# EAGLE design ColorsoundPowerBooster (EAGLE 9.2.0)
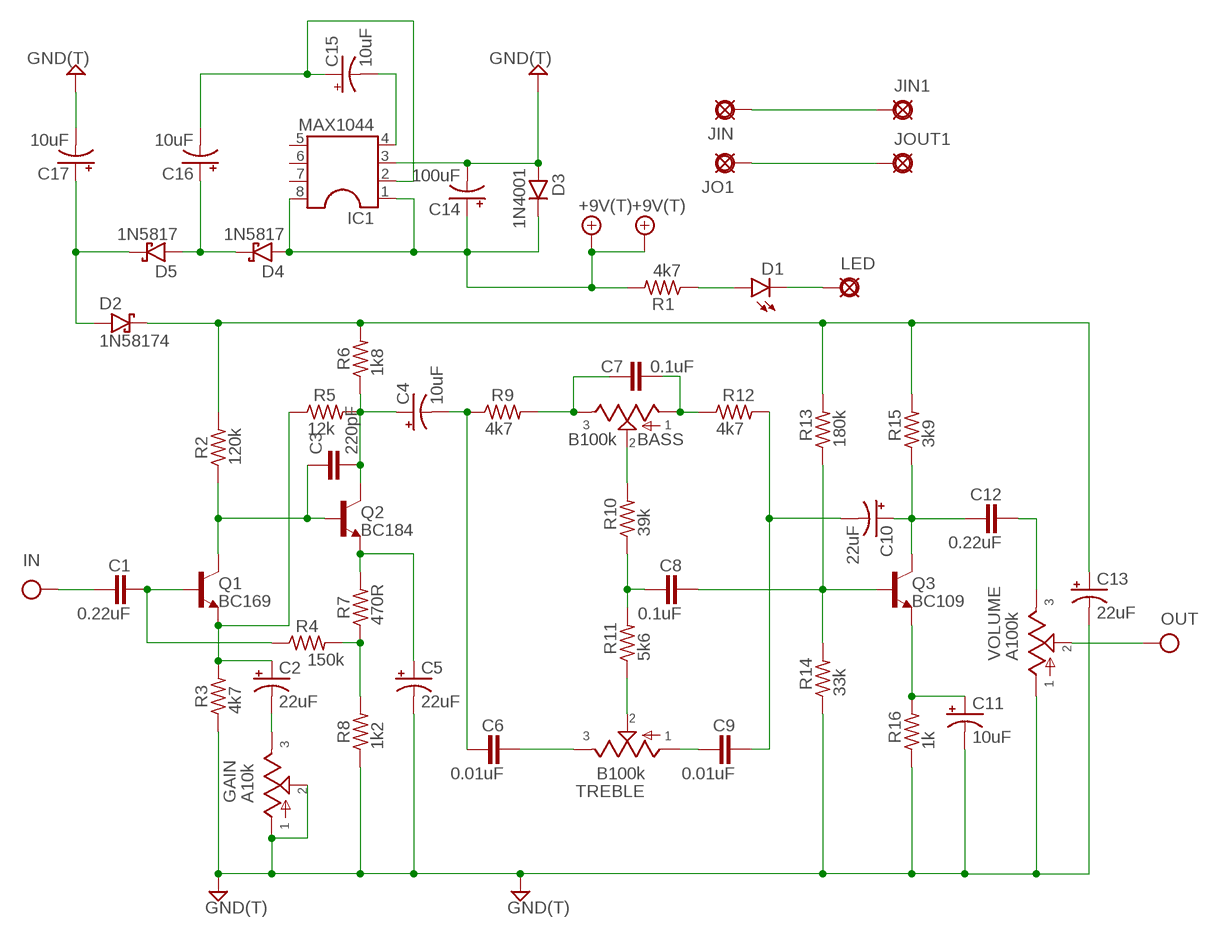
[diagram p0: schematic, sheet 1]

## Parts
+9V  +9V(T)  [SQUARE]
+9V1  +9V(T)  [SQUARE]
BASS  B100k  POT16MM  [16MM]
C1  0.22uF  072X0252  [072X025]
C2  22uF  0501  [050_020_1]
C3  220pF  050X030_0251  [050X030_025]
C4  10uF  0501  [050_020_1]
C5  22uF  0501  [050_020_1]
C6  0.01uF  072X0252  [072X025]
C7  0.1uF  072X0252  [072X025]
C8  0.1uF  072X0252  [072X025]
C9  0.01uF  072X0252  [072X025]
C10  22uF  0501  [050_020_1]
C11  10uF  0501  [050_020_1]
C12  0.22uF  072X0252  [072X025]
C13  22uF  0501  [050_020_1]
C14  100uF  0801  [080_035_1]
C15  10uF  0501  [050_020_1]
C16  10uF  0501  [050_020_1]
C17  10uF  0501  [050_020_1]
D1  LED  LED3MM  [LED3MM]
D2  1N58174  [DO41-4]
D3  1N4001  1N400X.3  [DO41-3]
D4  1N5817  [DO41-3]
D5  1N5817  [DO41-3]
G  GND(T)  [SQUARE]
G6  GND(T)  [SQUARE]
GAIN  A10k  POT16MM  [16MM]
IC1  MAX1044  [DIL08]
IN  IN(T)  [SQUARE]
JIG  GND(T)  [SQUARE]
JIN  PAD  [SQUARE]
JIN1  PAD  [SQUARE]
JO1  PAD  [SQUARE]
JOG  GND(T)  [SQUARE]
JOUT1  PAD  [SQUARE]
LED  PAD  [SQUARE]
OUT  OUT(T)  [SQUARE]
Q1  BC169  BC109  [TO92-]
Q2  BC184  BC109  [TO92-]
Q3  BC109  [TO92-]
R1  4k7  6MM.3  [R0207/3]
R2  120k  6MM.3  [R0207/3]
R3  4k7  6MM.3  [R0207/3]
R4  150k  6MM.3  [R0207/3]
R5  12k  6MM.3  [R0207/3]
R6  1k8  6MM.3  [R0207/3]
R7  470R  6MM.3  [R0207/3]
R8  1k2  6MM.3  [R0207/3]
R9  4k7  6MM.3  [R0207/3]
R10  39k  6MM.3  [R0207/3]
R11  5k6  6MM.3  [R0207/3]
R12  4k7  6MM.3  [R0207/3]
R13  180k  6MM.3  [R0207/3]
R14  33k  6MM.3  [R0207/3]
R15  3k9  6MM.3  [R0207/3]
R16  1k  6MM.3  [R0207/3]
TREBLE  B100k  POT16MM  [16MM]
VOLUME  A100k  POT16MM  [16MM]

## Nets
+9V: +9V1.1(+9V) +9V.1(+9V) C14.+ D3.C D4.A IC1.1 IC1.8 R1.2
GND: C5.- C11.- C13.- C14.- C17.- D3.A G6.1(GND) G.1(GND) GAIN.1 GAIN.2 IC1.3 JIG.1(GND) JOG.1(GND) R3.1 R8.1 R14.1 R16.1 VOLUME.1
IN: C1.1 IN.1(IN)
N$1: C4.- C6.1 R9.1
N$2: C6.2 TREBLE.3
N$3: C1.2 Q1.2(B) R4.1
N$4: C2.+ Q1.1(E) R3.2 R5.1
N$5: C2.- GAIN.3
N$6: C3.1 Q1.3(C) Q2.2(B) R2.1
N$7: C3.2 C4.+ Q2.3(C) R5.2 R6.1
N$8: C5.+ Q2.1(E) R7.2
N$9: R4.2 R7.1 R8.2
N$10: C13.+ D2.C R2.2 R6.2 R13.2 R15.2
N$11: R11.1 TREBLE.2
N$12: C8.1 R10.1 R11.2
N$13: BASS.2 R10.2
N$16: C9.2 C10.- R12.2
N$17: C8.2 Q3.2(B) R13.1 R14.2
N$18: C9.1 TREBLE.1
N$19: C10.+ C12.1 Q3.3(C) R15.1
N$20: C11.+ Q3.1(E) R16.2
N$21: D1.A R1.1
N$22: D1.K(C) LED.1(PAD)
N$23: C12.2 VOLUME.3
N$24: JIN1.1(PAD) JIN.1(PAD)
N$25: C15.- IC1.4
N$26: C15.+ C16.- IC1.2
N$27: C16.+ D4.C D5.A
N$28: C17.+ D2.A D5.C
N$29: JO1.1(PAD) JOUT1.1(PAD)
N$30: BASS.3 C7.1 R9.2
N$31: BASS.1 C7.2 R12.1
OUT: OUT.1(OUT) VOLUME.2
Unconnected: IC1.5 IC1.6 IC1.7

## Library data of the parts
+9V +9V1 = mb_supply:+9V(T): +9V Voltage Supply use this to hook up +9v throughout a schematic instead of running wire automatically labels the net "+9v" adds a hookup pad to the circuit board
BASS GAIN TREBLE VOLUME = mb_pots:POT: Potentiometers the arrow indicates the clockwise motion of th wiper (lug 2) fully counter clockwise there is no resistance between lugs 1 and 2 fully clockwise the resistance between lugs 1 and 2 is the value of the pot
C1 C6-C9 C12 = mb_caps-box:072X025: 1000pF - 0.47uF WIMA MKP2 63, 100V: 1000pF - 0.015uF; MKS2 50V: 0.33 - 0.47uF; 63V: 1000pF - 0.22uF;
C2 C4 C5 C10 C11 C13 C15-C17 = mb_caps-electro:050: 0.22 - 100uF Xicon values at Mouser.com: 10V: 10 - 100uF; 16V: 2.2 - 47uF; 25V: 0.47 - 47uF; 50V: 0.22 - 22uF
C3 = mb_caps-ceramic:050X030_025: 47 - 120pF Xicon Ceramic Disc 2.5mm lead spacing
C14 = mb_caps-electro:080: 47 - 470uF Xicon values at Mouser.com 10V: 330, 470uF; 16V: 220, 330uF; 25V: 220uF; 50V: 47, 100uF
D1 = mb_diodes:LED
D2 D4 D5 = mb_diodes:1N5817
D3 = mb_diodes:1N400X: Rectifier Diodes often used in power supply to prevent damage from reverse polarization
G G6 JIG JOG = mb_supply:GND(T): Ground use this to hook up ground (GND) throughout a schematic instead of running wire automatically labels the net "GND" adds a hookup pad to the circuit board (you can use several)
IC1 = mb_ics:MAX1044
IN = mb_supply:IN(T): Input obsolete: use Pad instead and label net shematic input label with circuit board terminal/pad generally used only once on a schematic (because this device labels the net "IN" in the same way as a voltage supply or ground net)
JIN JIN1 JO1 JOUT1 LED = mb_supply:PAD: PAD use this package for pads with any purpose, including input, output, send or return various pad shapes: round, square, octogonal, long, and long offset
OUT = mb_supply:OUT(T): Output obsolete: use Pad instead and label net output label with circuit board terminal/pad usually appears only once on a schematic
Q1-Q3 = mb_trans:BC109
R1-R16 = mb_resistors:6MM: 6mm Resistors Leads spaced 1-6 holes apart for 0.1" perfboard. Suitable for 1/4 watt resistors.

## Board
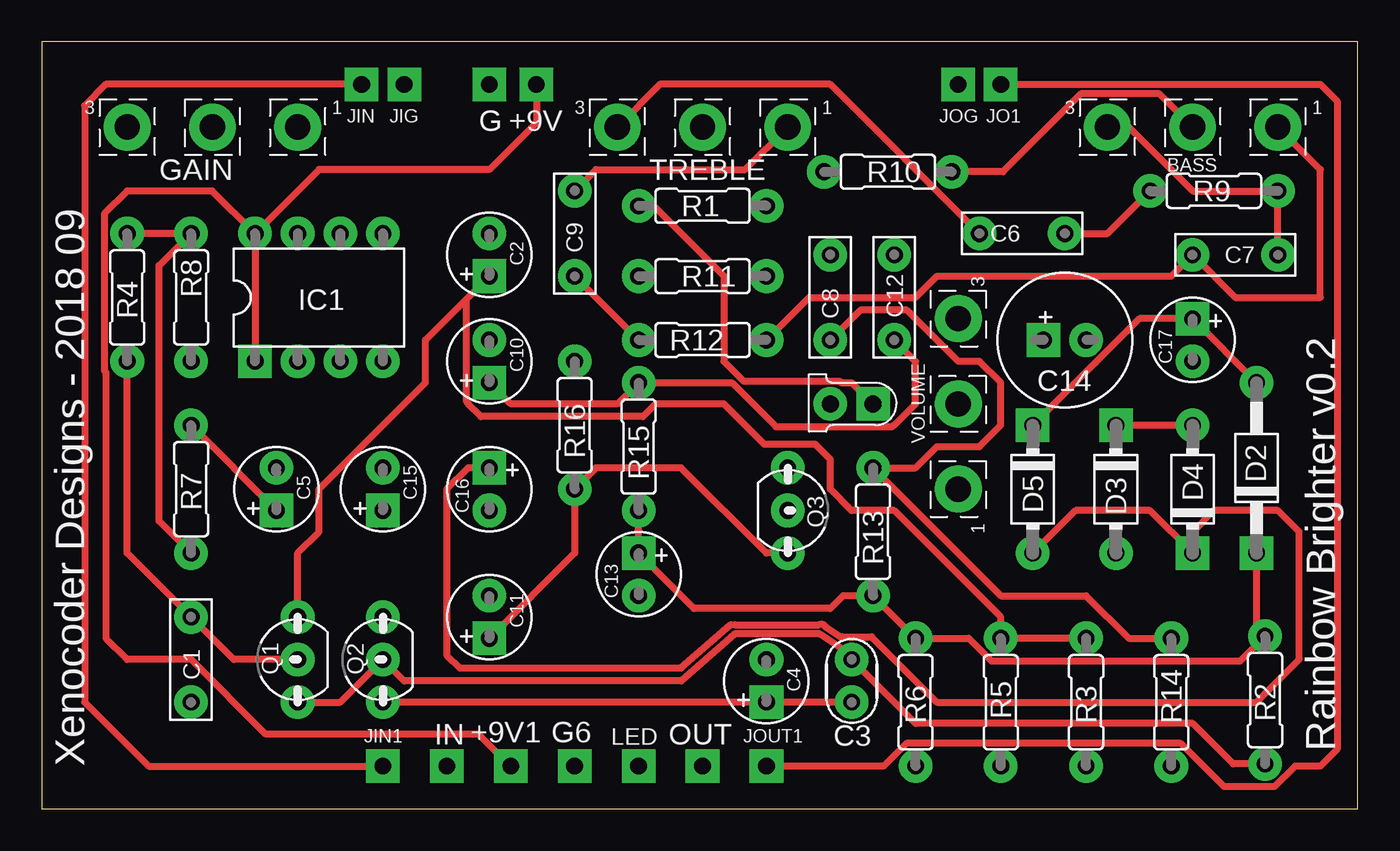
[diagram p1: board, top side]
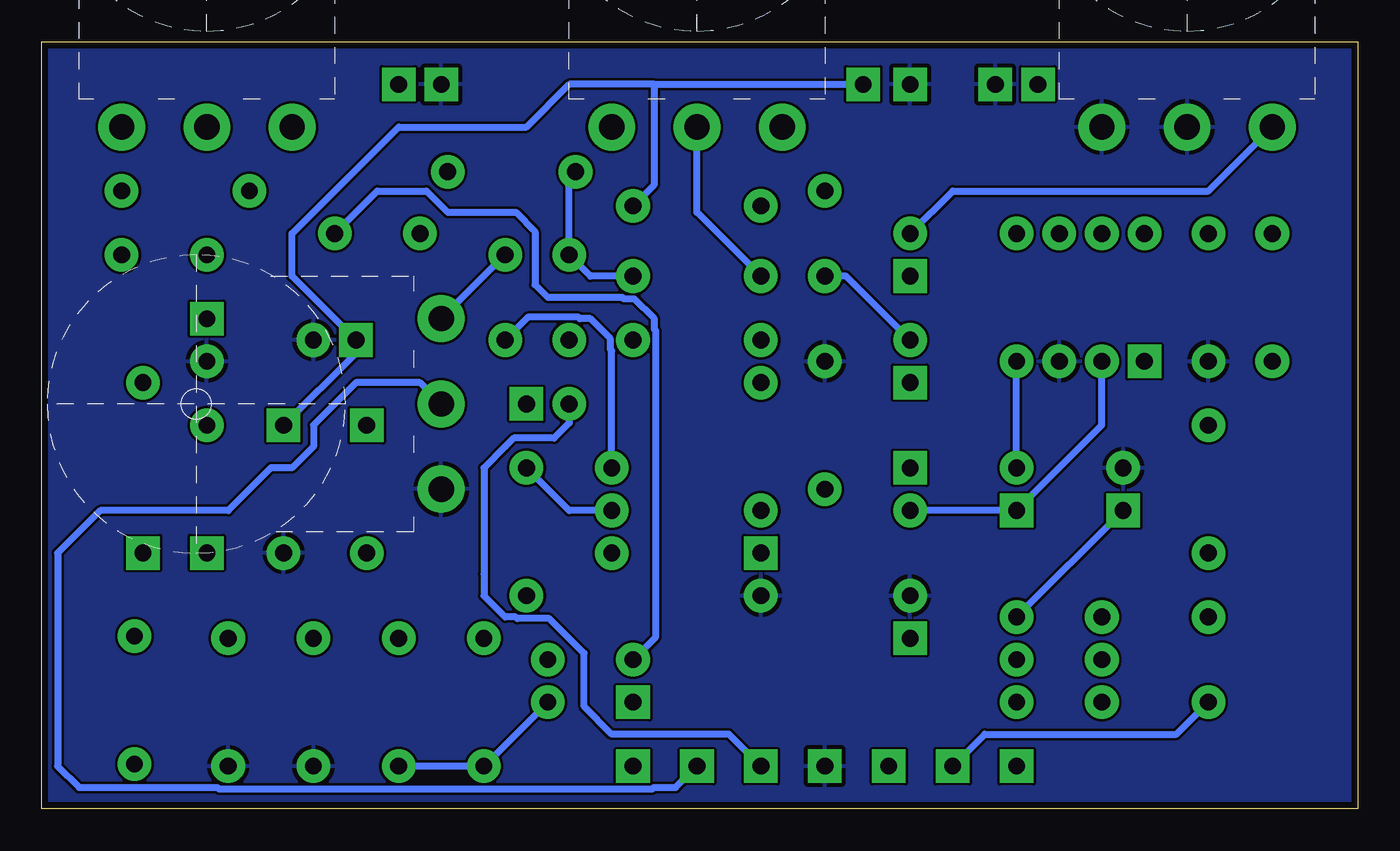
[diagram p2: board, bottom side, seen from below]

Size 78.41 x 45.71 mm. Coordinates in mm from the lower left corner, seen from the top.
Outline: 0,0 78.41,0 78.41,45.71 0,45.71 0,0
Copper layers (1*16): Top 0.035559375mm / dielectric 1.6mm / Bottom 0.035559375mm
Design rules "oshpark-2layer": minimum track width 6mil, minimum drill 10mil, track to track 6mil, track to pad 6mil, pad to pad 6mil, via to via 6mil, smd to smd 6mil, copper to edge 15mil, drill to drill 6mil, minimum pad ring 5mil, minimum via ring 5mil, stop-mask expansion 2.5mil, vias tented up to drill 0mil, thermal gap 10mil

### Footprints (pad centres in the part's own frame; a part is rotated, then mirrored left to right if it is on the bottom)
SQUARE = drill 1 pad 2 square: 1 0,0
16MM = drill 1.5 pad 2.794: 1 5.08,0; 2 0,0; 3 -5.08,0
072X025 = drill 1 pad 2: 1 -2.54,0; 2 2.54,0
050_020_1 = drill 1 pad 2 square: + -1.27,0 | drill 1 pad 2: - 1.27,0
050X030_025 = drill 1 pad 2: 1 -1.27,0; 2 1.27,0
080_035_1 = drill 1 pad 2 square: + -1.27,0 | drill 1 pad 2: - 1.27,0
LED3MM = drill 1 pad 2 square: A -1.27,0 | drill 1 pad 2: K 1.27,0
DO41-4 = drill 1 pad 2: A 5.08,0 | drill 1 pad 2 square: C -5.08,0
DO41-3 = drill 1 pad 2: A 3.81,0 | drill 1 pad 2 square: C -3.81,0
DIL08 = drill 1 pad 2 square: 1 -3.81,-3.81 | drill 1 pad 2: 2 -1.27,-3.81; 3 1.27,-3.81; 4 3.81,-3.81; 5 3.81,3.81; 6 1.27,3.81; 7 -1.27,3.81; 8 -3.81,3.81
TO92- = drill 1 pad 2: 1 2.54,0; 2 0,0; 3 -2.54,0
R0207/3 = drill 1 pad 2: 1 -3.81,0; 2 3.81,0

### Placement (x,y rotation side)
+9V  29.46,43.18 0 top
+9V1  27.94,2.54 0 top
BASS  68.58,40.64 0 top
C1  8.89,8.89 90 top
C2  26.67,33.02 90 top
C3  48.26,7.62 270 top
C4  43.18,7.62 90 top
C5  13.97,19.05 90 top
C6  58.42,34.29 180 top
C7  71.12,33.02 180 top
C8  46.99,30.48 270 top
C9  31.75,34.29 270 top
C10  26.67,26.67 90 top
C11  26.67,11.43 90 top
C12  50.8,30.48 90 top
C13  35.56,13.97 270 top
C14  60.96,27.94 0 top
C15  20.32,19.05 90 top
C16  26.67,19.05 270 top
C17  68.58,27.94 270 top
D1  48.26,24.13 180 top
D2  72.39,20.32 90 top
D3  64.01,19.05 270 top
D4  68.58,19.05 90 top
D5  59.05,19.05 270 top
G  26.67,43.18 0 top
G6  31.75,2.54 0 top
GAIN  10.16,40.64 0 top
IC1  16.51,30.48 0 top
IN  24.13,2.54 0 top
JIG  21.59,43.18 0 top
JIN  19.05,43.18 0 top
JIN1  20.32,2.54 0 top
JO1  57.15,43.18 0 top
JOG  54.61,43.18 0 top
JOUT1  43.18,2.54 0 top
LED  35.56,2.54 0 top
OUT  39.37,2.54 0 top
Q1  15.24,8.89 90 top
Q2  20.32,8.89 90 top
Q3  44.45,17.78 270 top
R1  39.37,35.94 0 top
R2  72.9,6.48 90 top
R3  62.23,6.35 90 top
R4  5.08,30.48 90 top
R5  57.15,6.35 270 top
R6  52.07,6.35 90 top
R7  8.89,19.05 90 top
R8  8.89,30.48 90 top
R9  69.85,36.83 0 top
R10  50.42,37.97 0 top
R11  39.37,31.75 0 top
R12  39.37,27.94 180 top
R13  49.53,16.51 270 top
R14  67.31,6.35 90 top
R15  35.56,21.59 270 top
R16  31.75,22.86 270 top
TREBLE  39.37,40.64 0 top
VOLUME  54.61,24.13 270 top

### Tracks (layer width: path | path; a pad name or v marks a point on that pad's centre or on a via)
+9V
  Top 0.406: D3.C D4.A | IC1.8 IC1.1 | +9V.1 29.46,40.89 26.67,38.1 16.51,38.1 IC1.8 | IC1.8 10.16,36.83 5.08,36.83 3.72,35.47 3.72,26.11 3.81,26.02 3.81,10.16 5.08,8.89 8.89,8.89 13.34,4.45 26.04,4.45 +9V1.1
  Bottom 0.406: D3.C 59.69,27.18 C14.+ 63.5,31.75 63.5,34.29 57.15,40.64 49.53,40.64 46.99,43.18 41.91,43.18 | 41.91,43.18 +9V.1 | R1.2 41.91,37.21 41.91,43.18
GND
  pour Bottom: 0,45.72 78.74,45.72 78.74,0 0,0
IN
  Bottom 0.406: IN.1 22.23,4.45 10.79,4.45 C1.1
N$1
  Top 0.406: C6.1 63.5,34.29 R9.1
  Bottom 0.406: C6.1 58.42,36.83 55.5,36.83 54.23,35.56 50.16,35.56 49.02,34.42 49.02,31.24 48.26,30.48 43.83,30.48 43.74,30.39 43.09,30.39 41.91,29.21 41.91,28.59 41.82,28.5 41.82,10.25 C4.-
N$2
  Top 0.406: C6.2 46.99,43.18 36.83,43.18 TREBLE.3
N$3
  Top 0.406: R4.1 5.08,15.24 C1.2 11.43,8.89 Q1.2
N$4
  Top 0.406: R3.2 R5.1 57.15,11.43 50.8,17.78 48.26,17.78 46.99,19.05 46.99,20.83 46.1,21.72 43.05,21.72 40.64,24.13 36.58,24.13 35.81,23.37 26.16,23.37 25.4,24.13 25.4,24.17 25.31,24.25 25.31,30.39 C2.+ 22.86,27.94 22.86,25.4 16.51,19.05 16.51,16.51 15.24,15.24 Q1.1
N$5
  Bottom 0.406: C2.- 24.13,36.83 8.89,36.83 GAIN.3
N$6
  Top 0.406: R2.1 70.99,2.67 68.58,5.08 52.07,5.08 C3.1 48.26,9.14 46.35,10.41 41.27,10.41 38.1,7.62 21.59,7.62 Q2.2 17.78,6.35 Q1.3
N$7
  Top 0.406: Q2.3 C4.+ C3.2
  Bottom 0.406: R5.2 R6.1 C3.2
N$8
  Top 0.406: R7.2 C5.+
  Bottom 0.406: Q2.1 C5.+
N$9
  Top 0.406: R4.2 R8.2 6.99,32.38 6.99,17.14 R7.1
N$10
  Top 0.406: D2.C 72.39,10.79 R2.2 71.42,8.8 56.59,8.8 55.23,10.16 R6.2 R13.2 47.75,12.7 46.99,11.94 38.86,11.94 C13.+ R15.2
N$11
  Bottom 0.406: R11.1 39.37,35.56 TREBLE.2
N$12
  Bottom 0.406: R10.1 46.99,37.59 C8.1 45.72,31.75 R11.2
N$13
  Top 0.406: BASS.2 66.6,42.62 61.92,42.62 57.28,37.97 R10.2
N$16
  Top 0.406: C9.2 R12.2
  Bottom 0.406: C10.- 30.48,31.75 C9.2
N$17
  Top 0.406: R14.2 64.77,10.16 62.23,12.7 57.15,12.7 R13.1 52.07,20.32 53.34,21.59 55.88,21.59 57.15,22.86 57.15,25.4 55.88,26.67 54.61,26.67 51.56,29.72 48.77,29.72 C8.2
  Bottom 0.406: Q3.2 46.99,17.78 R13.1
N$18
  Top 0.406: C9.1 33.02,38.1 41.91,38.1 TREBLE.1
N$19
  Top 0.406: C10.+ 27.94,24.13 34.29,24.13 R15.1 41.12,25.4 43.74,22.77 50.68,22.77 50.76,22.86 50.8,22.86 52.07,24.13 52.07,26.67 C12.1
  Bottom 0.406: Q3.3 44.45,27.29 44.54,27.38 44.54,28.03 45.72,29.21 46.34,29.21 46.43,29.3 49.44,29.3 C12.1
N$20
  Top 0.406: C11.+ 31.75,15.24 R16.2 33.02,20.32 38.1,20.32 43.18,15.24 Q3.1
N$21
  Top 0.406: R1.1 36.45,35.94 40.64,31.75 40.64,26.67 41.82,25.49 47.55,25.49 47.64,25.4 48.26,25.4 D1.A
N$22
  Bottom 0.406: D1.K 46.99,22.99 47.88,22.1 50.29,22.1 50.8,21.59 52.07,20.32 52.07,13.97 52.07,12.7 50.8,11.43 50.18,11.43 50.09,11.34 48.17,11.34 46.1,9.27 46.1,6.1 44.45,4.45 37.47,4.45 LED.1
N$23
  Bottom 0.406: VOLUME.3 C12.2
N$24
  Top 0.406: JIN.1 3.81,43.18 2.54,41.91 2.54,6.35 6.35,2.54 JIN1.1
N$25
  Bottom 0.406: C15.- IC1.4
N$26
  Bottom 0.406: IC1.2 15.24,22.86 C15.+ C16.-
N$27
  Top 0.406: D5.A 61.59,17.78 66.04,17.78 D4.C 68.58,16.51 69.85,17.78 73.66,17.78 74.93,16.51 74.93,8.89 72.39,6.35 53.34,6.35 49.44,10.25 47.7,10.25 47.66,10.21 46.71,10.85 46.59,10.97 46.52,10.97 46.47,11.01 46.3,10.97 41.29,10.97 41.08,10.99 41.06,10.97 41.04,10.97 38.1,8.38 24.89,8.38 24.13,9.14 24.13,19.05 25.4,20.32 C16.+
N$28
  Top 0.406: D5.C 62.78,26.58 62.79,26.58 65.42,29.21 C17.+ D2.A
N$29
  Top 0.406: JO1.1 76.2,43.18 77.19,42.19 77.19,3.53 76.2,2.54 74.69,2.54 73.46,1.31 70.46,1.31 67.87,3.9 51.51,3.9 50.15,2.54 JOUT1.1
N$30
  Top 0.406: C7.1 R9.2 68.58,36.83 64.77,40.64 BASS.3
N$31
  Top 0.406: BASS.1 76.2,38.1 76.2,30.48 71.12,30.48 C7.2 67.31,31.75 53.34,31.75 52.07,30.48 45.72,30.48 R12.1
OUT
  Bottom 0.406: VOLUME.2 55.88,25.4 59.69,25.4 62.23,22.86 62.23,21.59 63.5,20.32 64.77,20.32 67.31,17.78 74.93,17.78 77.47,15.24 77.47,2.54 76.2,1.27 67.96,1.27 67.87,1.18 42.03,1.18 41.95,1.27 40.64,1.27 OUT.1

### Text on the board
tNames: Xenocoder Designs - 2018 09 | Rainbow Brighter v0.2